# Altium schematic sheet Analog_inputs.SchDoc: Analog Inputs
size A; DrawnBy: Andrew Pobrica; DocumentNumber: 7; SheetNumber: 7; SheetTotal: 7
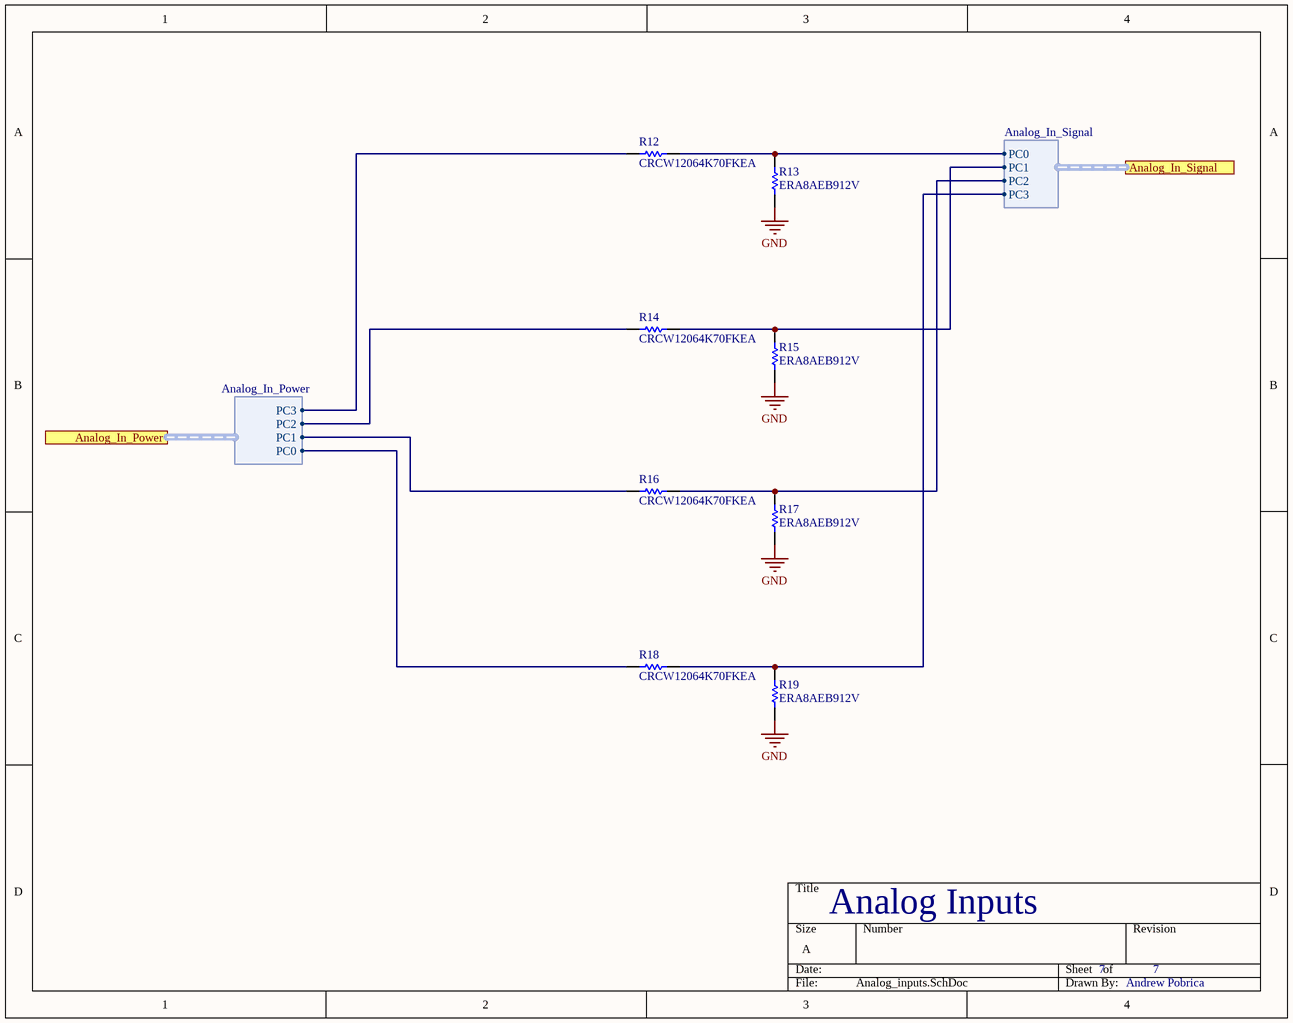
[diagram p0: Analog_inputs.SchDoc]

## Parts
R12  CRCW12064K70FKEA  [RESC3216X60X45ML15T20]
R13  ERA8AEB912V  [RESC3216X70X50ML20T25]
R14  CRCW12064K70FKEA  [RESC3216X60X45ML15T20]
R15  ERA8AEB912V  [RESC3216X70X50ML20T25]
R16  CRCW12064K70FKEA  [RESC3216X60X45ML15T20]
R17  ERA8AEB912V  [RESC3216X70X50ML20T25]
R18  CRCW12064K70FKEA  [RESC3216X60X45ML15T20]
R19  ERA8AEB912V  [RESC3216X70X50ML20T25]

## Ports
Analog_In_Power (harness Analog_In_Power), Analog_In_Signal (harness Analog_In_Signal)

## Harnesses
Analog_In_Signal: PC0, PC1, PC2, PC3
Analog_In_Power: PC0, PC1, PC2, PC3

## Nets
GND: R13.2 R15.2 R17.2 R19.2
NetR12_1: R12.1 R13.1 ; port Analog_In_Signal.PC0
NetR12_2: R12.2 ; port Analog_In_Power.PC3
NetR14_1: R14.1 R15.1 ; port Analog_In_Signal.PC1
NetR14_2: R14.2 ; port Analog_In_Power.PC2
NetR16_1: R16.1 R17.1 ; port Analog_In_Signal.PC2
NetR16_2: R16.2 ; port Analog_In_Power.PC1
NetR18_1: R18.1 R19.1 ; port Analog_In_Signal.PC3
NetR18_2: R18.2 ; port Analog_In_Power.PC0

## Library data of the parts
R12 R14 R16 R18 = CMP-2100-03618-1: Chip Resistor, 4.7 KOhm, +/- 1%, 0.25 W, -55 to 155 degC, 1206 (3216 Metric), RoHS, Tape and Reel; Manufacturer: Vishay Semiconductor; Power Rating: 250mW; Voltage Rating: 200V; Temperature Coefficient: 100ppm/degreesC; Package Quantity: 10; Composition: ThickFilm; REACH SVHC: Unknown; Mount: SurfaceMount; Max Operating Temperature: 155degC; Length: 3.2mm; Number of Terminations: 2; Case Code (Metric): 3216; Military Standard: Not; Width: 1.6mm; Datasheet Version: 41061.0; Max Power Dissipation: 250mW; Datasheet URL: http://www.vishay.com/docs/20035/dcrcwe3.pdf; Contact Plating: Tin; Case/Package: 1206; Height: 0.55mm; Package Reference: 1206.0; Lead Free: LeadFree; Weight: 0.000353oz; Package Description: 2-Pin Surface Mount Device, Body 3.15 x 1.6 mm; Min Operating Temperature: -55degC; Resistance: 4.7KOhm; Packaging: TapeandReel; Depth: 1.6mm; Tolerance: 1%; RoHSCompliant: true; Termination: SMD/SMT; Case Code (Imperial): 1206; Voltage Rating (DC): 200V; Radiation Hardening: No; Manufacturer URL: http://www.vishay.com/
R13 R15 R17 R19 = CMP-2003-00013-1: Manufacturer: Panasonic; Part Number: ERA8AEB912V